# EAGLE design Diff_LPF (EAGLE 9.6.2)
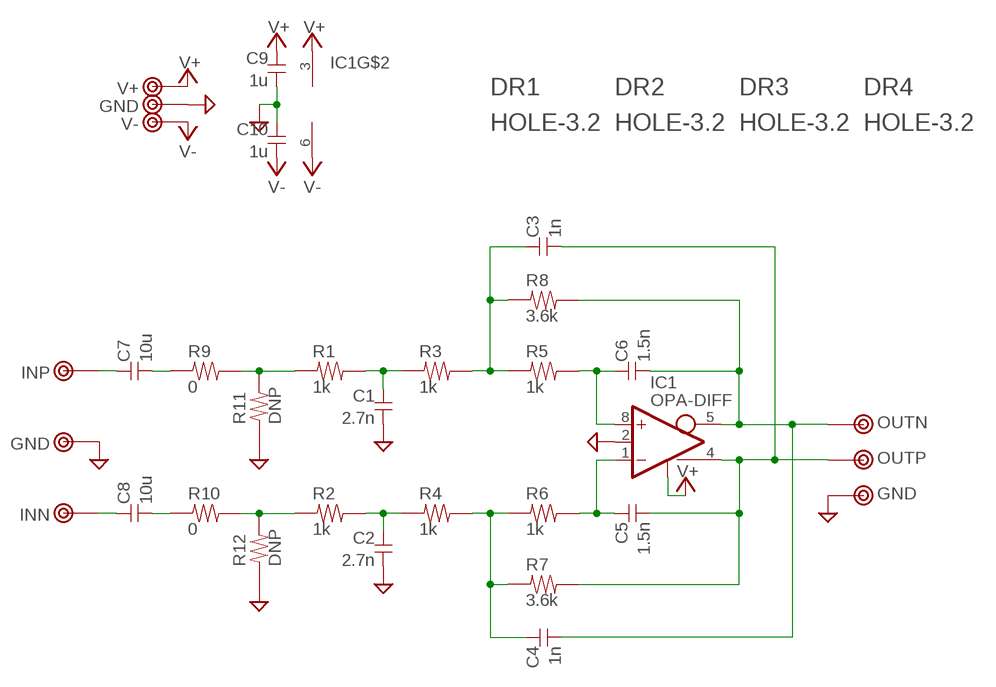
[diagram p0: schematic, sheet 1]

## Parts
C1  2.7n  C-1608  [1608C]
C2  2.7n  C-1608  [1608C]
C3  1n  C-1608  [1608C]
C4  1n  C-1608  [1608C]
C5  1.5n  C-1608  [1608C]
C6  1.5n  C-1608  [1608C]
C7  10u  C-5W  [C050W]
C8  10u  C-5W  [C050W]
C9  1u  C-1608  [1608C]
C10  1u  C-1608  [1608C]
DR1  HOLE-3.2  [HOLE_3.2]
DR2  HOLE-3.2  [HOLE_3.2]
DR3  HOLE-3.2  [HOLE_3.2]
DR4  HOLE-3.2  [HOLE_3.2]
IC1  OPA-DIFF  [SOP8]
R1  1k  R-1608  [1608]
R2  1k  R-1608  [1608]
R3  1k  R-1608  [1608]
R4  1k  R-1608  [1608]
R5  1k  R-1608  [1608]
R6  1k  R-1608  [1608]
R7  3.6k  R-1608  [1608]
R8  3.6k  R-1608  [1608]
R9  0  R-1608  [1608]
R10  0  R-1608  [1608]
R11  DNP  R-1608  [1608]
R12  DNP  R-1608  [1608]
TP1  INP  TESTPIN-MID  [TESTPIN-MID]
TP2  INN  TESTPIN-MID  [TESTPIN-MID]
TP3  OUTN  TESTPIN-MID  [TESTPIN-MID]
TP4  OUTP  TESTPIN-MID  [TESTPIN-MID]
TP5  V+  TESTPIN-MID  [TESTPIN-MID]
TP6  GND  TESTPIN-MID  [TESTPIN-MID]
TP7  V-  TESTPIN-MID  [TESTPIN-MID]
TP8  GND  TESTPIN-MID  [TESTPIN-MID]
TP9  GND  TESTPIN-MID  [TESTPIN-MID]

## Nets
GND: C1.2 C2.2 C9.2 C10.1 IC1.2(CM) R11.1 R12.1 TP6.1 TP8.1 TP9.1
N$1: R1.1 R9.2 R11.2
N$2: R2.1 R10.2 R12.2
N$3: C1.1 R1.2 R3.1
N$4: C2.1 R2.2 R4.1
N$5: C6.1 IC1.8(+IN) R5.2
N$6: C4.2 C6.2 IC1.5(-OUT) R8.2 TP3.1
N$7: C3.2 C5.2 IC1.4(+OUT) R7.2 TP4.1
N$8: C5.1 IC1.1(-IN) R6.2
N$9: C4.1 R4.2 R6.1 R7.1
N$10: C3.1 R3.2 R5.1 R8.1
N$11: C7.2 C7.4 R9.1
N$12: C8.2 C8.4 R10.1
N$13: C7.1 C7.3 TP1.1
N$14: C8.1 C8.3 TP2.1
V+: C9.1 IC1.3(V+) IC1.7(EN) TP5.1
V-: C10.2 IC1.6(V-) TP7.1

## Library data of the parts
C1-C10 = my_rcl:C
DR1-DR4 = my_connector:HOLE-3.2
IC1 = my_ic:OPA-DIFF
R1-R12 = my_rcl:R
TP1-TP9 = my_connector:TESTPIN

## Board
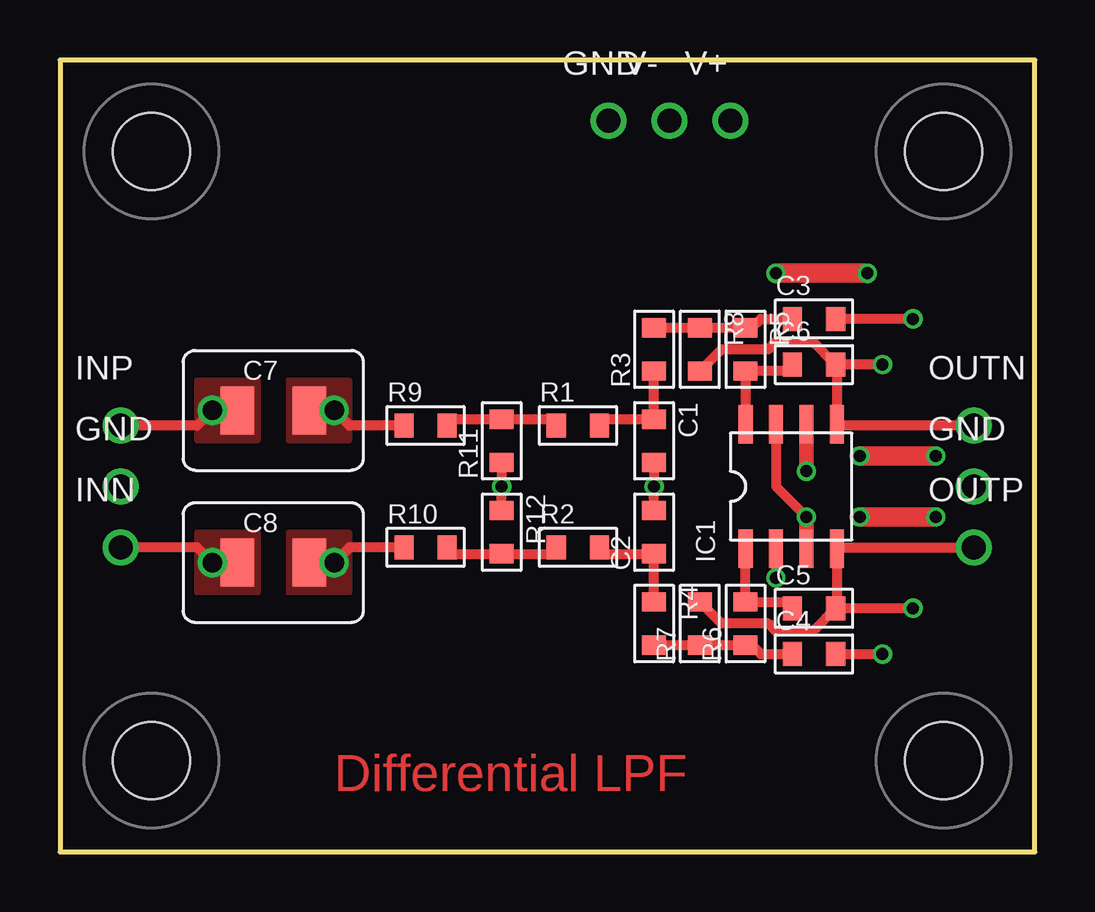
[diagram p1: board, top side]
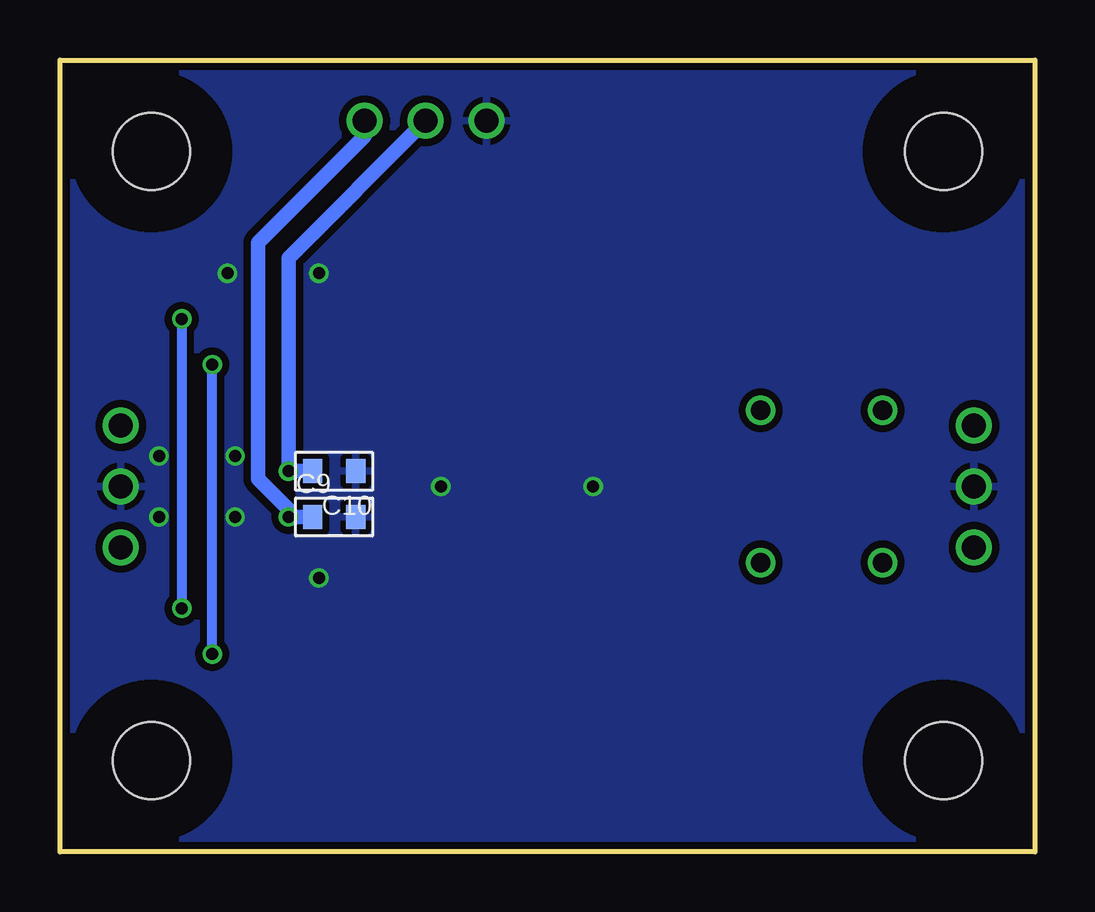
[diagram p2: board, bottom side, seen from below]

Size 40.64 x 33.02 mm. Coordinates in mm from the lower left corner, seen from the top.
Outline: 0,33.02 0,0 40.64,0 40.64,33.02 0,33.02
Copper layers (1*16): Top 0.035mm / dielectric 1.5mm / Bottom 0.035mm
Design rules "SeeedStudio_2layer_DRU_20140221 *": minimum track width 6mil, minimum drill 0.5mm, track to track 8mil, track to pad 8mil, pad to pad 8mil, via to via 12mil, smd to smd 0mil, copper to edge 0.3mm, drill to drill 10mil, minimum pad ring 0.15mm, minimum via ring 6mil, stop-mask expansion 2mil, vias tented up to drill 1mm, thermal gap 10mil

### Footprints (pad centres in the part's own frame; a part is rotated, then mirrored left to right if it is on the bottom)
1608C = smd 0.8 x 1: 1 -0.9,0; 2 0.9,0
C050W = drill 0.813: 1 -2.54,0; 2 2.54,0 | smd 1.4 x 2: 3 -1.5,0; 4 1.5,0
HOLE_3.2 = hole 3.2: 0,0
SOP8 = smd 0.6 x 1.6: 1 -1.905,-2.6; 2 -0.635,-2.6; 3 0.635,-2.6; 4 1.905,-2.6; 5 1.905,2.6; 6 0.635,2.6; 7 -0.635,2.6; 8 -1.905,2.6
1608 = smd 0.8 x 1: 1 -0.9,0; 2 0.9,0
TESTPIN-MID = drill 1 pad 1.4: 1 0,0

### Placement (x,y rotation side)
C1  24.77,17.14 270 top
C2  24.77,13.34 90 top
C3  31.43,22.23 0 top
C4  31.43,8.26 0 top
C5  31.43,10.16 0 top
C6  31.43,20.32 0 top
C7  8.89,18.41 0 top
C8  8.89,12.06 0 top
C9  29.21,13.97 0 bottom
C10  29.21,15.88 180 bottom
DR1  36.83,3.81 0 top
DR2  3.81,3.81 0 top
DR3  36.83,29.21 0 top
DR4  3.81,29.21 0 top
IC1  30.48,15.24 0 top
R1  21.59,17.78 0 top
R2  21.59,12.7 0 top
R3  24.77,20.95 90 top
R4  24.77,9.53 270 top
R5  28.57,20.95 270 top
R6  28.57,9.53 90 top
R7  26.67,9.53 90 top
R8  26.67,20.95 270 top
R9  15.24,17.78 0 top
R10  15.24,12.7 0 top
R11  18.41,17.14 90 top
R12  18.41,13.34 270 top
TP1  2.54,17.78 0 top
TP2  2.54,12.7 0 top
TP3  38.1,17.78 0 top
TP4  38.1,12.7 0 top
TP5  27.94,30.48 0 top
TP6  22.86,30.48 0 top
TP7  25.4,30.48 0 top
TP8  2.54,15.24 0 top
TP9  38.1,15.24 0 top

### Tracks (layer width: path | path; a pad name or v marks a point on that pad's centre or on a via)
GND  (via drill 0.5)
  Top 0.406: R12.1 v18.41,15.24 R11.1 | C2.2 v24.77,15.24 C1.2 | IC1.2 v29.84,11.43
  Top 0.813: v29.84,24.13 v33.66,24.13 | v36.51,16.51 v33.34,16.51 | v33.34,13.97 v36.51,13.97
  pour Bottom (isolate 0.305): 0,33.02 0,0 40.64,0 40.64,33.02
N$1
  Top 0.406: R9.2 16.41,18.05 R11.2 20.43,18.05 R1.1
N$2
  Top 0.406: R10.2 16.41,12.44 R12.2 20.43,12.44 R2.1
N$3
  Top 0.406: R1.2 22.75,18.05 C1.1 R3.1
N$4
  Top 0.406: R2.2 22.75,12.44 C2.1 R4.1
N$5
  Top 0.406: C6.1 30.27,20.05 R5.2 IC1.8
N$6  (via drill 0.5)
  Top 0.406: C6.2 32.38,20.27 IC1.5 32.45,17.78 TP3.1 | C4.2 v34.29,8.26 | v34.29,20.32 C6.2 | R8.2 27.57,20.95 29.53,20.95 29.84,21.27 31.38,21.27 C6.2
  Bottom 0.406: v34.29,8.26 v34.29,20.32
N$7  (via drill 0.5)
  Top 0.406: C5.2 32.38,10.21 IC1.4 32.45,12.7 TP4.1 | v35.56,22.23 C3.2 | v35.56,10.16 C5.2 | R7.2 27.57,9.53 29.53,9.53 29.84,9.21 31.38,9.21 C5.2
  Bottom 0.406: v35.56,22.23 v35.56,10.16
N$8
  Top 0.406: IC1.1 R6.2 30.27,10.43 C5.1
N$9
  Top 0.406: C4.1 29.21,8.26 28.84,8.62 R6.1 R7.1 R4.2
N$10
  Top 0.406: C3.1 29.21,22.23 28.84,21.86 R5.1 R8.1 R3.2
N$11
  Top 0.406: R9.1 12.06,17.78 C7.2 C7.4
  pour Top (isolate 0.305, no thermals): 12.06,19.68 12.06,17.14 9.53,17.14 9.53,19.68
N$12
  Top 0.406: R10.1 12.06,12.7 C8.2 C8.4
  pour Top (isolate 0.305, no thermals): 12.06,13.34 12.06,10.79 9.53,10.79 9.53,13.34
N$13
  Top 0.406: TP1.1 5.71,17.78 C7.1 C7.3
  pour Top (isolate 0.305, no thermals): 8.26,19.68 8.26,17.14 5.71,17.14 5.71,19.68
N$14
  Top 0.406: TP2.1 5.71,12.7 C8.1 C8.3
  pour Top (isolate 0.305, no thermals): 8.26,13.34 8.26,10.79 5.71,10.79 5.71,13.34
V+  (via drill 0.5)
  Top 0.406: IC1.7 29.84,15.24 v31.11,13.97
  Top 0.61: IC1.3 v31.11,13.97
  Bottom 0.61: C9.1 v31.11,13.97 31.11,14.29 32.38,15.56 32.38,25.4 27.94,29.84 TP5.1
V-  (via drill 0.5)
  Top 0.61: IC1.6 v31.11,15.88
  Bottom 0.61: C10.2 v31.11,15.88 31.11,24.77 TP7.1

### Text on the board
Top: Differential LPF